# EAGLE schematic USB_DLT (EAGLE 9.4.2)
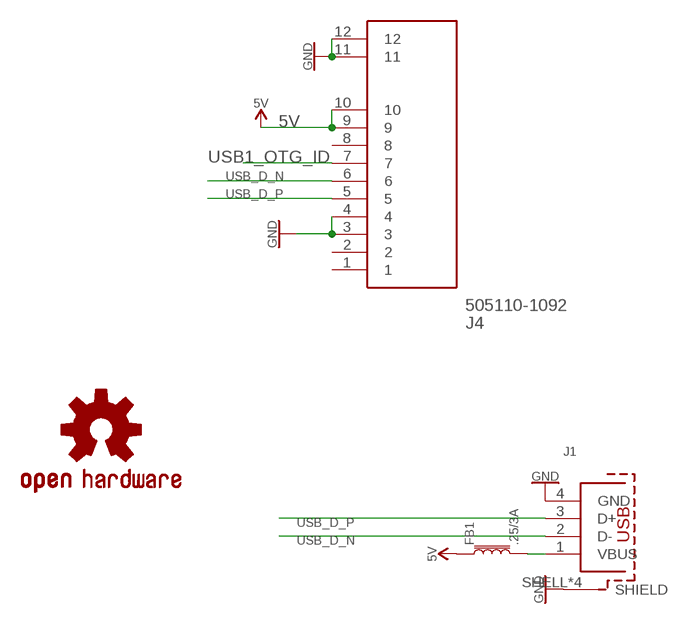
[diagram p0: schematic, sheet 1]

## Parts
FB1  .25/3A  FERRITE_BEAD-0603  [0603]
J1  629104190121  [629104190121]
J4  505110-1092  [5051101092]
LOGO1  OSHW-LOGOS-COPPER  [OSHW-LOGO-S_COPPER]

## Nets
5V: FB1.1 J4.9 J4.10
5V_FB: FB1.2 J1.1(VBUS)
GND: J1.4(GND) J1.SHELL1(SHIELD) J1.SHELL2(SHIELD) J1.SHELL3(SHIELD) J1.SHELL(SHIELD) J4.3 J4.4 J4.11 J4.12
USB1_OTG_ID: J4.7
USB_D_N: J1.2(D-) J4.6
USB_D_P: J1.3(D+) J4.5
Unconnected: J4.1 J4.2 J4.8

## Library data of the parts
FB1 = SparkFun-Coils:FERRITE_BEAD: Ferrite Bead (blocks, cores, rings, chokes, etc.) Inductor with layers of ferrite used to suppress high frequencies. Often used to isolate high frequency noise. SparkFun Products: IOIO-OTG - V2.2 <https://www.sparkfun.com/products/13613> SparkFun SAMD21 Mini Breakout <https://www.sparkfun.com/products/13664> SparkFun 6 Degrees of Freedom Breakout - LSM6DS3 <https://www.sparkfun.com/products/13339> SparkFun SAMD21 Dev Breakout <https://www.sparkfun.com/products/13672>; PROD_ID: NDUC-13805; VALUE: 30Ω/1.8A
J1 = EAGLE-INPUT_OUTPUT_CONNECTORS-rev17a:629104190121: USB 2.0 Type A Horizontal SMT Short Type WR-COM_629104190121 <http://katalog.we-online.de/media/images/v2/Family_WR-COM_629104190121.jpg> Details see: http://katalog.we-online.de/en/em/COM_2_0_SMT_TYPE_A_HORIZONTAL_SHORT_TYPE/629104190121 Created bY Yingchun,Shan 2016 (C) Würth Elektronik
J4 = SamacSys_Parts:505110-1092: Molex Easy-On Series 0.5mm Pitch 10 Way Right Angle SMT Male FPC Connector, ZIF Bottom Contact Source: Datasheet <https://componentsearchengine.com/Datasheets/1/505110-1092.pdf>; DESCRIPTION: Molex Easy-On Series 0.5mm Pitch 10 Way Right Angle SMT Male FPC Connector, ZIF Bottom Contact; HEIGHT: 0mm; MANUFACTURER_NAME: Molex; MANUFACTURER_PART_NUMBER: 505110-1092; MOUSER_PART_NUMBER: 538-505110-1092; MOUSER_PRICE-STOCK: https://www.mouser.com/Search/Refine.aspx?Keyword=538-505110-1092
LOGO1 = SparkFun-Aesthetics:OSHW-LOGO: Open-Source Hardware (OSHW) Logo This logo indicates the piece of hardware it is found on incorporates a OSHW license and/or adheres to the definition of open source hardware found here: http://freedomdefined.org/OSHW